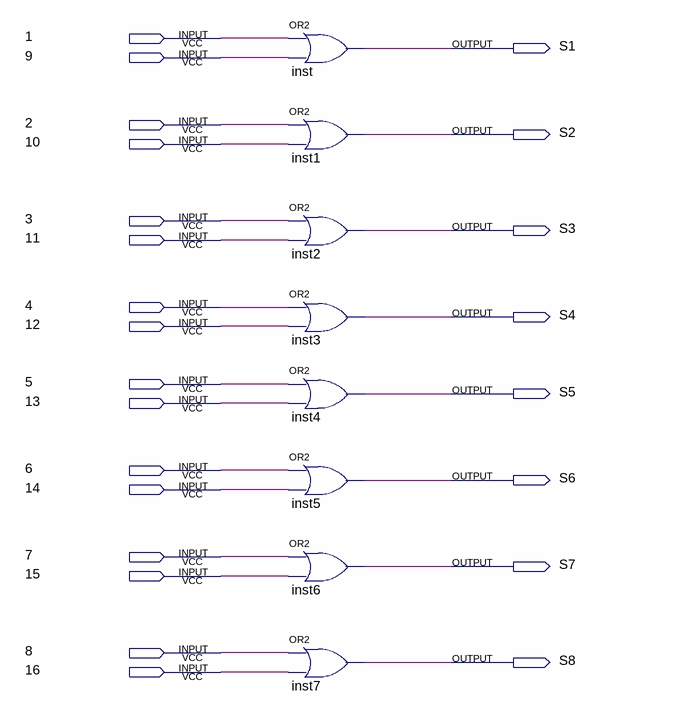
[diagram p0: schematic sheet]
// Quartus schematic Modular.bdf as structural Verilog: 8 symbols, 24 pins
module Modular (
  input  \1 ,
  input  \9 ,
  input  \2 ,
  input  \10 ,
  input  \3 ,
  input  \11 ,
  input  \4 ,
  input  \12 ,
  input  \5 ,
  input  \13 ,
  input  \6 ,
  input  \14 ,
  input  \7 ,
  input  \15 ,
  input  \8 ,
  input  \16 ,
  output S1,
  output S2,
  output S3,
  output S4,
  output S5,
  output S6,
  output S7,
  output S8
);

  or inst (S1, \1 , \9 );
  or inst1 (S2, \2 , \10 );
  or inst2 (S3, \3 , \11 );
  or inst3 (S4, \4 , \12 );
  or inst4 (S5, \5 , \13 );
  or inst5 (S6, \6 , \14 );
  or inst6 (S7, \7 , \15 );
  or inst7 (S8, \8 , \16 );
endmodule
